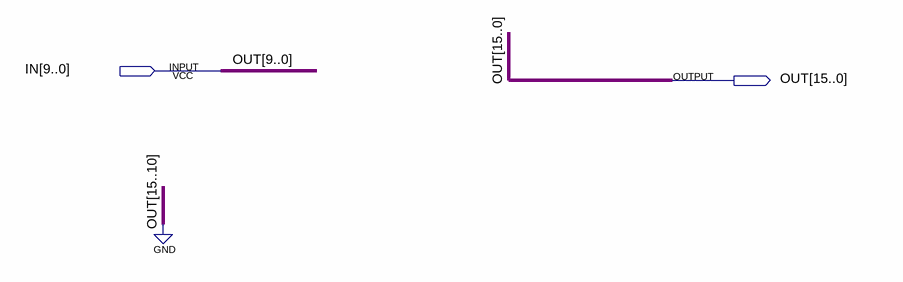
[diagram p0: schematic sheet]
// Quartus schematic SIGNEXTEND10_16.bdf as structural Verilog: 0 symbols, 2 pins
module SIGNEXTEND10_16 (
  input  [9:0] IN,
  output [15:0] OUT
);


  assign OUT = {{6{1'b0}}, IN};
endmodule
